# EasyEDA schematic ESP32_Clock_Easy.json
TITLE: Sheet_1; REV: 1.0; Date: 2022-12-27; Sheet: 1/1; Drawn By: a_qin; Company: Your Company
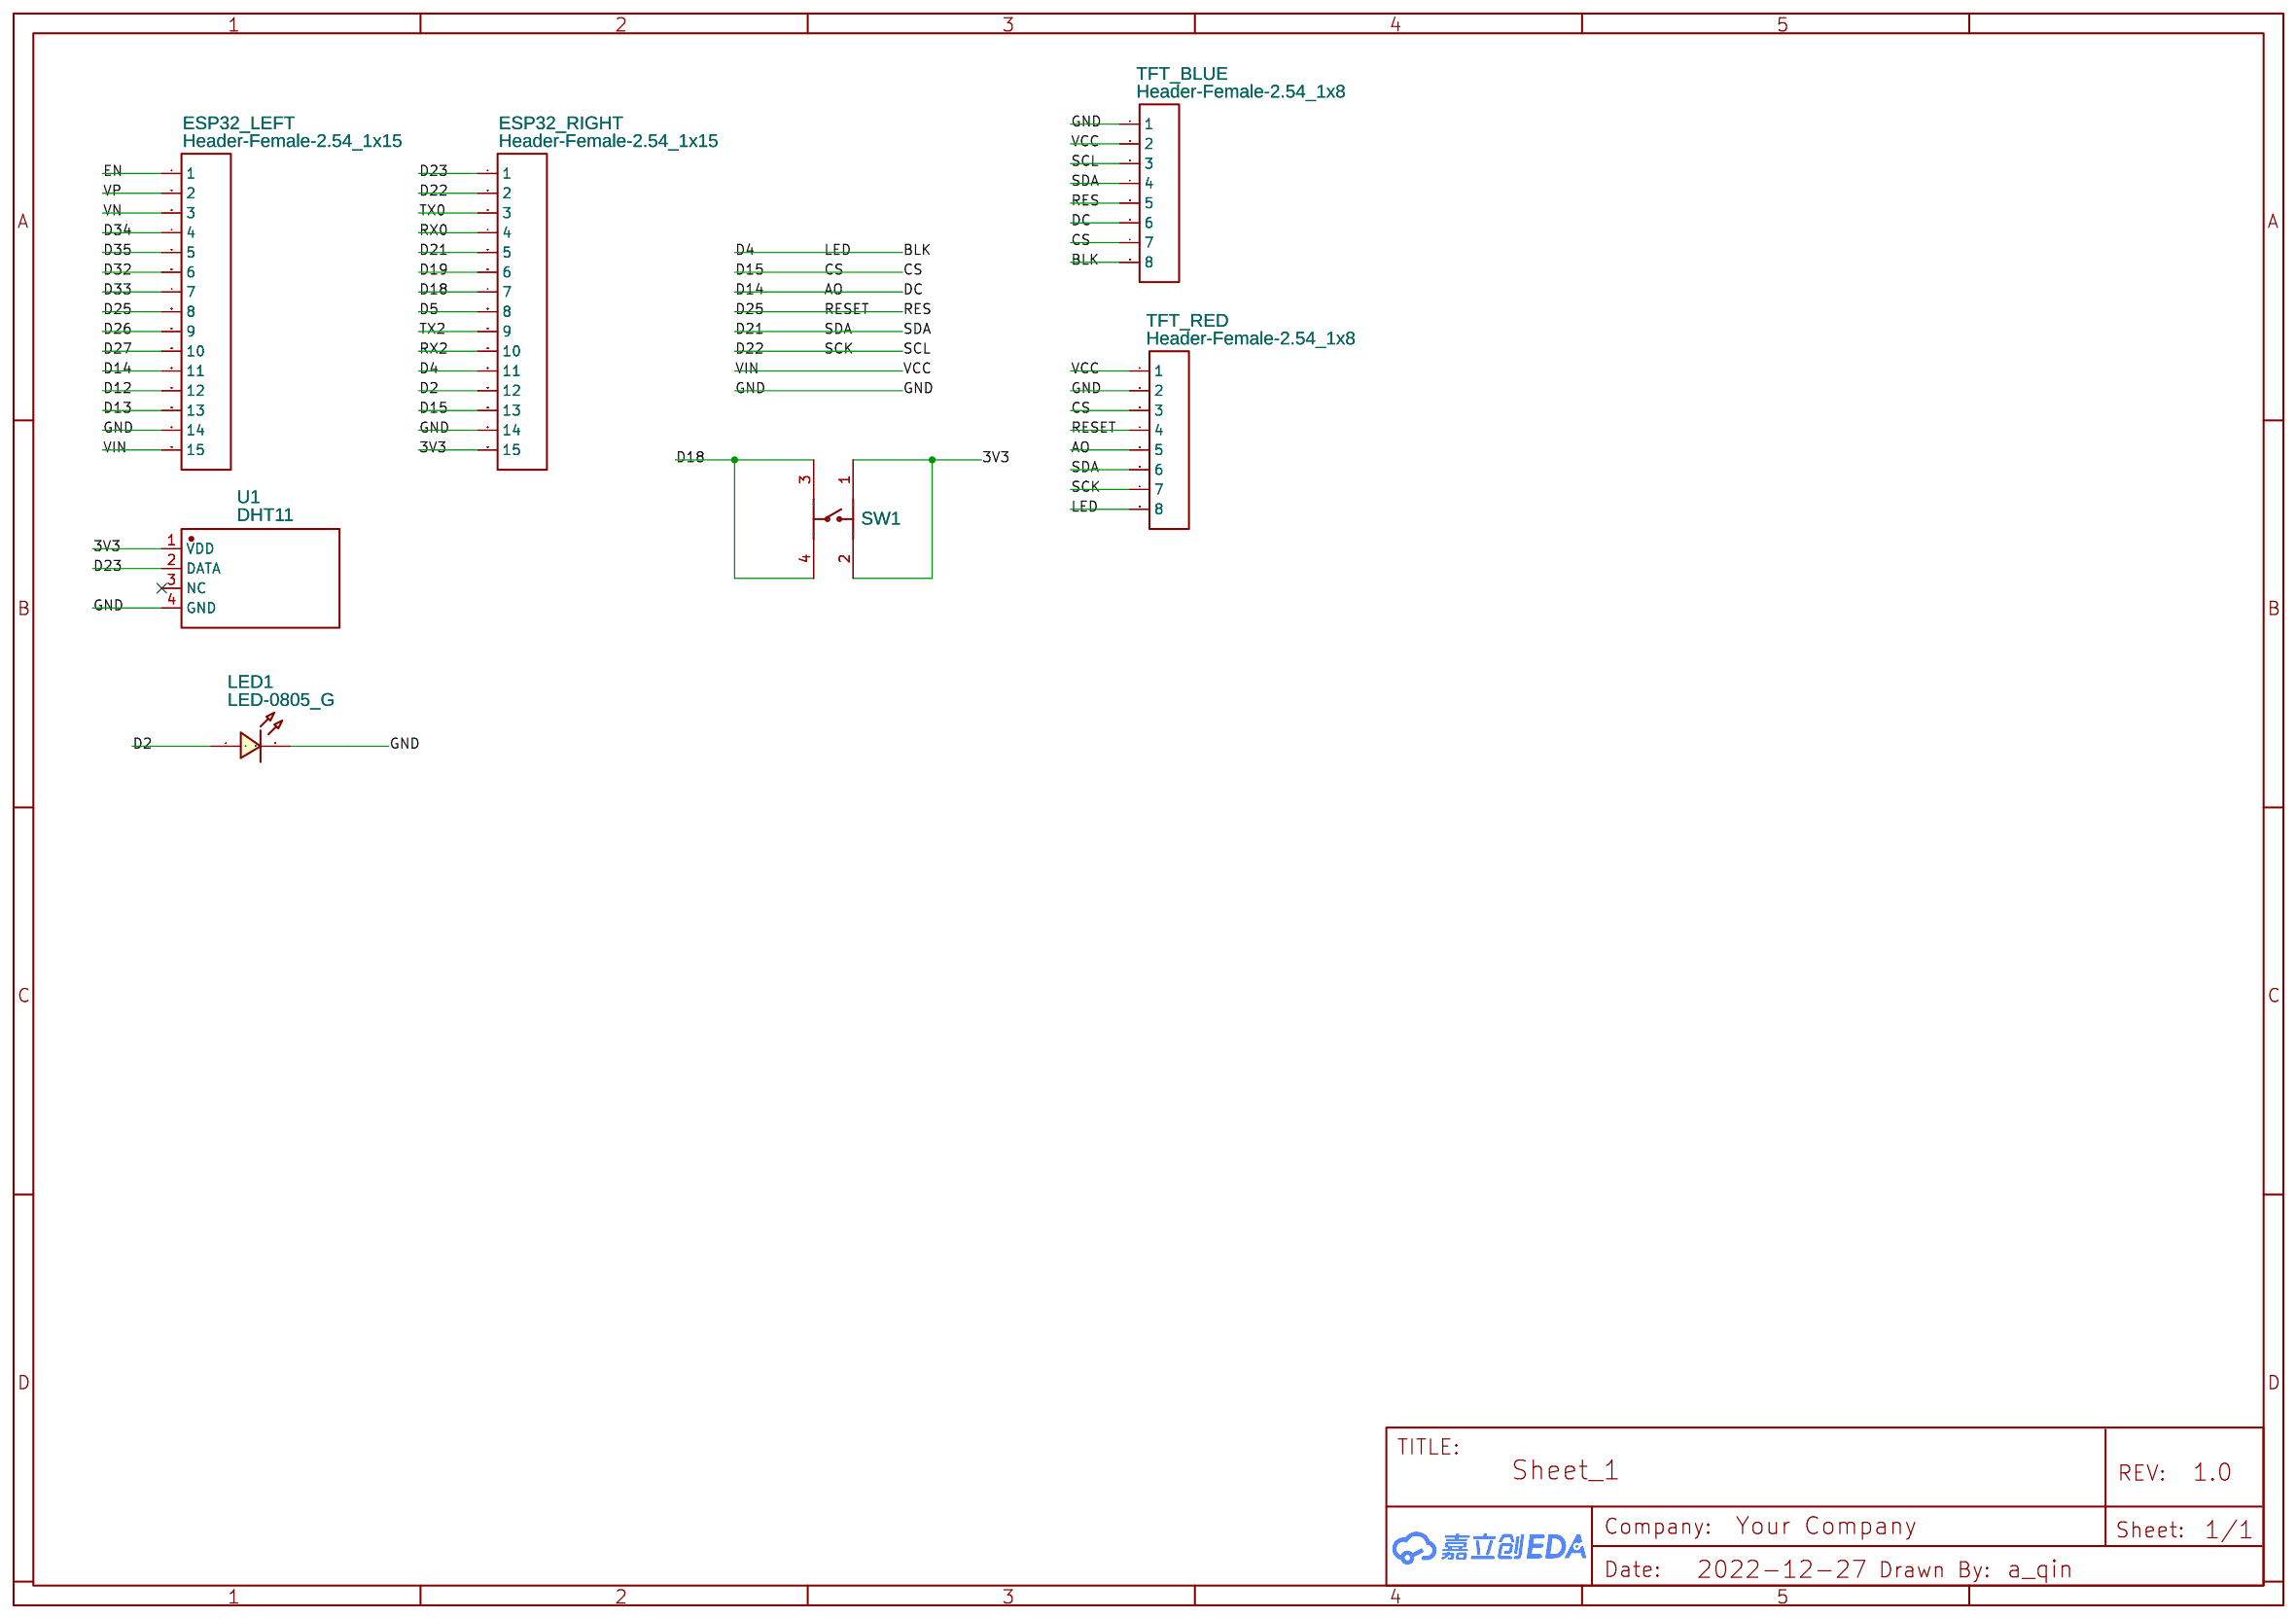
[diagram p0: schematic sheet]

## Parts
ESP32_LEFT  Header-Female-2.54_1x15  [HDR-TH_15P-P2.54-V-F-1]
ESP32_RIGHT  Header-Female-2.54_1x15  [HDR-TH_15P-P2.54-V-F-1]
LED1  LED-0805_G  [LED0805_GREEN]
SW1  PTS645SK50-2LFS  [KEY-TH_4P-L6.0-W6.0-P4.50-LS6.50]
TFT_BLUE  Header-Female-2.54_1x8  [HDR-TH_8P-P2.54-V-F-1]
TFT_RED  Header-Female-2.54_1x8  [HDR-TH_8P-P2.54-V-F-1]
U1  DHT11  [SENSOR-TH_DHT11]

## Library data of the parts
ESP32_LEFT ESP32_RIGHT = Header-Female-2.54_1x15: Supplier: LCSC; Manufacturer: Ckmtw(灿科盟); Manufacturer Part: B-2200S15P-A120; Supplier Part: C124408; JLCPCB Part Class: Extended Part
LED1 = LED-0805_G: Manufacturer: 国星光电; Manufacturer Part: NCD0805G1; Supplier Part: C84260; Contributor: LCEDA_Lib
SW1 = PTS645SK50-2LFS: Supplier: LCSC; Supplier Part: C2689653; Manufacturer: C&K; Contributor: LCSC
TFT_BLUE TFT_RED = Header-Female-2.54_1x8: Supplier: LCSC; Manufacturer: BOOMELE(博穆精密); Manufacturer Part: 2.54-1*8P母环保; Supplier Part: C27438; JLCPCB Part Class: Extended Part
U1 = DHT11: Supplier: LCSC; Supplier Part: C117051; Manufacturer: 广州奥松; Contributor: LCSC; JLCPCB Part Class: Extended Part

## Nets
3V3: ESP32_RIGHT.15 SW1.1 SW1.2 U1.1(VDD)
GND: ESP32_LEFT.14 ESP32_RIGHT.14 LED1.2 TFT_BLUE.1 TFT_RED.2 U1.4(GND)
VCC: ESP32_LEFT.15 TFT_BLUE.2 TFT_RED.1
AO: ESP32_LEFT.11 TFT_BLUE.6 TFT_RED.5
BLK: ESP32_RIGHT.11 TFT_BLUE.8 TFT_RED.8
CS: ESP32_RIGHT.13 TFT_BLUE.7 TFT_RED.3
D2: ESP32_RIGHT.12 LED1.1
D5: ESP32_RIGHT.8
D12: ESP32_LEFT.12
D13: ESP32_LEFT.13
D18: ESP32_RIGHT.7 SW1.3 SW1.4
D19: ESP32_RIGHT.6
D21: ESP32_RIGHT.5 TFT_BLUE.4 TFT_RED.6
D22: ESP32_RIGHT.2 TFT_BLUE.3 TFT_RED.7
D23: ESP32_RIGHT.1 U1.2(DATA)
D25: ESP32_LEFT.8 TFT_BLUE.5 TFT_RED.4
D26: ESP32_LEFT.9
D27: ESP32_LEFT.10
D32: ESP32_LEFT.6
D33: ESP32_LEFT.7
D34: ESP32_LEFT.4
D35: ESP32_LEFT.5
EN: ESP32_LEFT.1
RX0: ESP32_RIGHT.4
RX2: ESP32_RIGHT.10
TX0: ESP32_RIGHT.3
TX2: ESP32_RIGHT.9
VN: ESP32_LEFT.3
VP: ESP32_LEFT.2

Not connected (* = marked no-connect by the designer): U1 3(NC)*
